# EAGLE schematic sac_4klep (EAGLE 7.2.0)
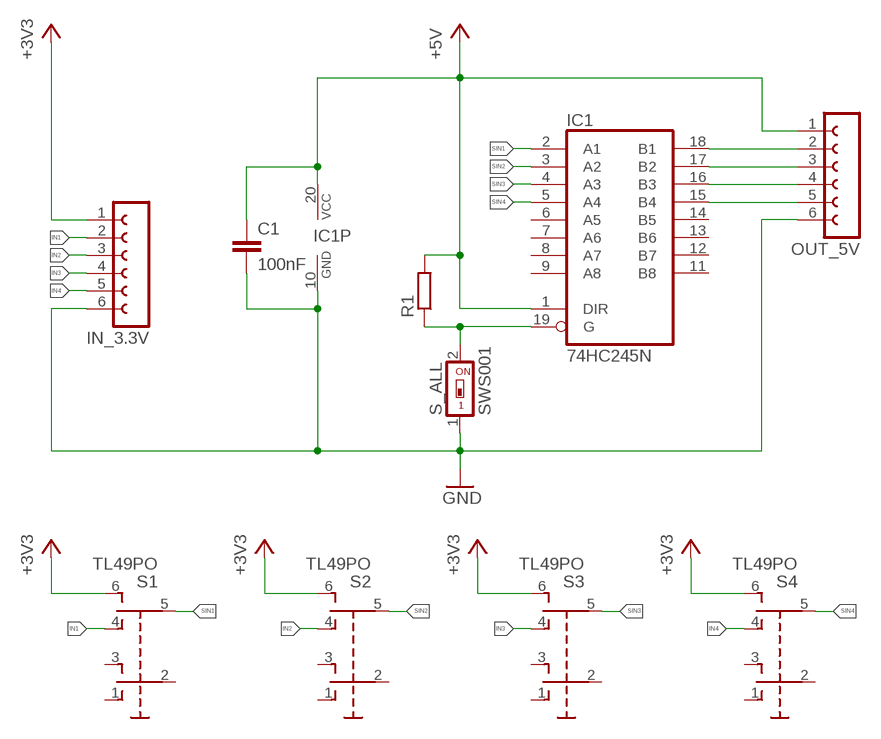
[diagram p0: schematic, sheet 1]

## Parts
C1  100nF  C-EU025-040X050  [C025-040X050]
IC1  74HC245N  [DIL20]
IN_3.3V  FE06-1  [FE06]
OUT_5V  FE06-1  [FE06]
R1  R-EU_0204/5  [0204/5]
S1  TL49PO  [TL4XPO]
S2  TL49PO  [TL4XPO]
S3  TL49PO  [TL4XPO]
S4  TL49PO  [TL4XPO]
S_ALL  SWS001  [SMS-001]

## Nets
+3V3: IN_3.3V.1 S1.6(S1) S2.6(S1) S3.6(S1) S4.6(S1)
+5V: C1.1 IC1.1(DIR) IC1.20(VCC) OUT_5V.1 R1.2
GND: C1.2 IC1.10(GND) IN_3.3V.6 OUT_5V.6 S_ALL.1
IN1: IN_3.3V.2 S1.4(O1)
IN2: IN_3.3V.3 S2.4(O1)
IN3: IN_3.3V.4 S3.4(O1)
IN4: IN_3.3V.5 S4.4(O1)
N$5: IC1.18(B1) OUT_5V.2
N$6: IC1.17(B2) OUT_5V.3
N$7: IC1.16(B3) OUT_5V.4
N$8: IC1.15(B4) OUT_5V.5
N$9: IC1.19(G) R1.1 S_ALL.2
SIN1: IC1.2(A1) S1.5(P1)
SIN2: IC1.3(A2) S2.5(P1)
SIN3: IC1.4(A3) S3.5(P1)
SIN4: IC1.5(A4) S4.5(P1)
Unconnected: IC1.6(A5) IC1.7(A6) IC1.8(A7) IC1.9(A8) IC1.11(B8) IC1.12(B7) IC1.13(B6) IC1.14(B5) S1.1(O) S1.2(P) S1.3(S) S2.1(O) S2.2(P) S2.3(S) S3.1(O) S3.2(P) S3.3(S) S4.1(O) S4.2(P) S4.3(S)

## Library data of the parts
C1 = resistor:C-EU: CAPACITOR, European symbol
IC1 = 74xx-eu:74*245: Octal BUS TRANSCEIVER, 3-state
IN_3.3V OUT_5V = con-lsta:FE06-1: FEMALE HEADER; OC_FARNELL: unknown; OC_NEWARK: unknown
R1 = resistor:R-EU_: RESISTOR, European symbol
S1-S4 = switch:TL49PO: TINY SWITCH ON OFF ON Source: http://www2.produktinfo.conrad.com/datenblaetter/700000-724999/705152-da-01-de-Subminiaturschalter_TL_36YO.pdf
S_ALL = smd-special:SWS001: SMD Dip Switch 1 pol.